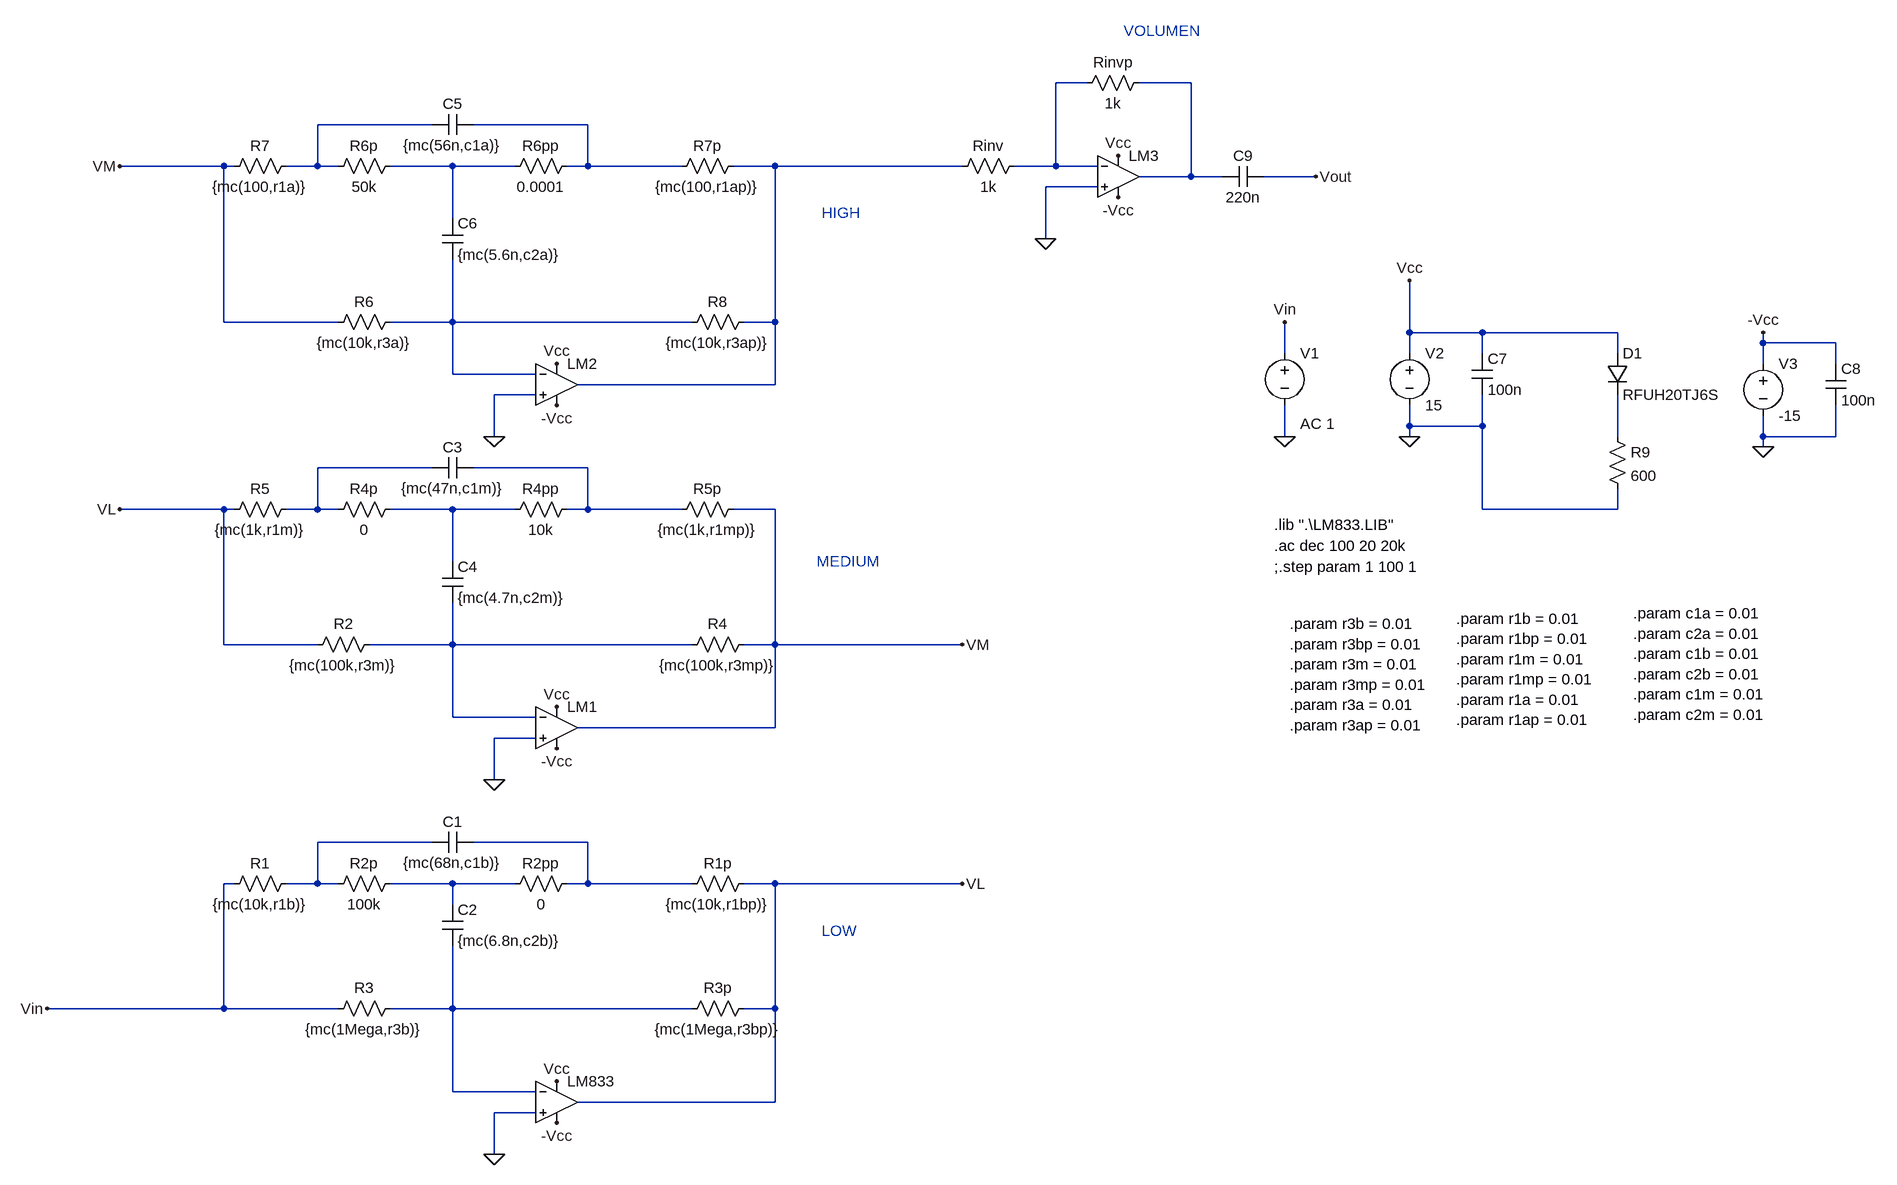
[diagram p0: schematic Circuito.asc]
Circuito.asc, the LTspice schematic file:
Version 4
SHEET 1 3748 680
WIRE 2528 -1184 2480 -1184
WIRE 2688 -1184 2608 -1184
WIRE 1520 -1120 1344 -1120
WIRE 1760 -1120 1584 -1120
WIRE 1200 -1056 1040 -1056
WIRE 1216 -1056 1200 -1056
WIRE 1344 -1056 1344 -1120
WIRE 1344 -1056 1296 -1056
WIRE 1376 -1056 1344 -1056
WIRE 1552 -1056 1456 -1056
WIRE 1648 -1056 1552 -1056
WIRE 1760 -1056 1760 -1120
WIRE 1760 -1056 1728 -1056
WIRE 1904 -1056 1760 -1056
WIRE 2048 -1056 1984 -1056
WIRE 2336 -1056 2048 -1056
WIRE 2480 -1056 2480 -1184
WIRE 2480 -1056 2416 -1056
WIRE 2544 -1056 2480 -1056
WIRE 2688 -1040 2688 -1184
WIRE 2688 -1040 2608 -1040
WIRE 2736 -1040 2688 -1040
WIRE 2880 -1040 2800 -1040
WIRE 2544 -1024 2464 -1024
WIRE 1552 -976 1552 -1056
WIRE 2464 -944 2464 -1024
WIRE 1200 -816 1200 -1056
WIRE 1376 -816 1200 -816
WIRE 1552 -816 1552 -912
WIRE 1552 -816 1456 -816
WIRE 1920 -816 1552 -816
WIRE 2048 -816 2048 -1056
WIRE 2048 -816 2000 -816
WIRE 3024 -800 3024 -880
WIRE 3136 -800 3024 -800
WIRE 3344 -800 3136 -800
WIRE 3568 -784 3568 -800
WIRE 3680 -784 3568 -784
WIRE 2832 -768 2832 -816
WIRE 3024 -768 3024 -800
WIRE 3136 -768 3136 -800
WIRE 3344 -768 3344 -800
WIRE 3568 -752 3568 -784
WIRE 3680 -752 3680 -784
WIRE 1552 -736 1552 -816
WIRE 1680 -736 1552 -736
WIRE 2048 -720 2048 -816
WIRE 2048 -720 1744 -720
WIRE 1680 -704 1616 -704
WIRE 3024 -656 3024 -688
WIRE 3136 -656 3136 -704
WIRE 3136 -656 3024 -656
WIRE 1616 -640 1616 -704
WIRE 2832 -640 2832 -688
WIRE 3024 -640 3024 -656
WIRE 3344 -640 3344 -704
WIRE 3568 -640 3568 -672
WIRE 3680 -640 3680 -688
WIRE 3680 -640 3568 -640
WIRE 3568 -624 3568 -640
WIRE 1520 -592 1344 -592
WIRE 1760 -592 1584 -592
WIRE 1200 -528 1040 -528
WIRE 1216 -528 1200 -528
WIRE 1344 -528 1344 -592
WIRE 1344 -528 1296 -528
WIRE 1376 -528 1344 -528
WIRE 1552 -528 1456 -528
WIRE 1648 -528 1552 -528
WIRE 1760 -528 1760 -592
WIRE 1760 -528 1728 -528
WIRE 1904 -528 1760 -528
WIRE 2048 -528 1984 -528
WIRE 3136 -528 3136 -656
WIRE 3344 -528 3344 -560
WIRE 3344 -528 3136 -528
WIRE 1552 -448 1552 -528
WIRE 1200 -320 1200 -528
WIRE 1344 -320 1200 -320
WIRE 1552 -320 1552 -384
WIRE 1552 -320 1424 -320
WIRE 1920 -320 1552 -320
WIRE 2048 -320 2048 -528
WIRE 2048 -320 2000 -320
WIRE 2336 -320 2048 -320
WIRE 1552 -208 1552 -320
WIRE 1680 -208 1552 -208
WIRE 2048 -192 2048 -320
WIRE 2048 -192 1744 -192
WIRE 1680 -176 1616 -176
WIRE 1616 -112 1616 -176
WIRE 1520 -16 1344 -16
WIRE 1760 -16 1584 -16
WIRE 1216 48 1200 48
WIRE 1344 48 1344 -16
WIRE 1344 48 1296 48
WIRE 1376 48 1344 48
WIRE 1552 48 1456 48
WIRE 1648 48 1552 48
WIRE 1760 48 1760 -16
WIRE 1760 48 1728 48
WIRE 1920 48 1760 48
WIRE 2048 48 2000 48
WIRE 2336 48 2048 48
WIRE 1552 80 1552 48
WIRE 1200 240 1200 48
WIRE 1200 240 928 240
WIRE 1376 240 1200 240
WIRE 1552 240 1552 144
WIRE 1552 240 1456 240
WIRE 1920 240 1552 240
WIRE 2048 240 2048 48
WIRE 2048 240 2000 240
WIRE 1552 368 1552 240
WIRE 1680 368 1552 368
WIRE 2048 384 2048 240
WIRE 2048 384 1744 384
WIRE 1680 400 1616 400
WIRE 1616 464 1616 400
FLAG 2832 -640 0
FLAG 3024 -640 0
FLAG 3568 -624 0
FLAG 1616 464 0
FLAG 2832 -816 Vin
FLAG 2880 -1040 Vout
FLAG 3024 -880 Vcc
FLAG 1712 352 Vcc
FLAG 3568 -800 -Vcc
FLAG 1712 416 -Vcc
FLAG 2464 -944 0
FLAG 2576 -1072 Vcc
FLAG 2576 -1008 -Vcc
FLAG 1616 -112 0
FLAG 1712 -224 Vcc
FLAG 1712 -160 -Vcc
FLAG 1616 -640 0
FLAG 1712 -752 Vcc
FLAG 1712 -688 -Vcc
FLAG 928 240 Vin
FLAG 1040 -528 VL
FLAG 2336 48 VL
FLAG 2336 -320 VM
FLAG 1040 -1056 VM
SYMBOL res 1472 32 R90
WINDOW 0 0 56 VBottom 2
WINDOW 3 32 56 VTop 2
SYMATTR InstName R2p
SYMATTR Value 100k
SYMBOL res 1744 32 R90
WINDOW 0 0 56 VBottom 2
WINDOW 3 32 56 VTop 2
SYMATTR InstName R2pp
SYMATTR Value 0
SYMBOL res 1472 224 R90
WINDOW 0 0 56 VBottom 2
WINDOW 3 32 56 VTop 2
SYMATTR InstName R3
SYMATTR Value {mc(1Mega,r3b)}
SYMATTR SpiceLine tol=5
SYMBOL res 2016 224 R90
WINDOW 0 0 56 VBottom 2
WINDOW 3 32 56 VTop 2
SYMATTR InstName R3p
SYMATTR Value {mc(1Mega,r3bp)}
SYMATTR SpiceLine tol=5
SYMBOL cap 1536 80 R0
SYMATTR InstName C2
SYMATTR Value {mc(6.8n,c2b)}
SYMBOL cap 1584 -32 R90
WINDOW 0 0 32 VBottom 2
WINDOW 3 32 32 VTop 2
SYMATTR InstName C1
SYMATTR Value {mc(68n,c1b)}
SYMBOL res 1312 32 R90
WINDOW 0 0 56 VBottom 2
WINDOW 3 32 56 VTop 2
SYMATTR InstName R1
SYMATTR Value {mc(10k,r1b)}
SYMATTR SpiceLine tol=1
SYMBOL res 2016 32 R90
WINDOW 0 0 56 VBottom 2
WINDOW 3 32 56 VTop 2
SYMATTR InstName R1p
SYMATTR Value {mc(10k,r1bp)}
SYMATTR SpiceLine tol=1
SYMBOL voltage 2832 -784 R0
WINDOW 123 24 124 Left 2
WINDOW 39 0 0 Left 0
SYMATTR Value2 AC 1
SYMATTR InstName V1
SYMATTR Value ""
SYMBOL voltage 3024 -784 R0
SYMATTR InstName V2
SYMATTR Value 15
SYMBOL voltage 3568 -768 R0
SYMATTR InstName V3
SYMATTR Value -15
SYMBOL res 1472 -544 R90
WINDOW 0 0 56 VBottom 2
WINDOW 3 32 56 VTop 2
SYMATTR InstName R4p
SYMATTR Value 0
SYMBOL res 1744 -544 R90
WINDOW 0 0 56 VBottom 2
WINDOW 3 32 56 VTop 2
SYMATTR InstName R4pp
SYMATTR Value 10k
SYMBOL cap 1584 -608 R90
WINDOW 0 0 32 VBottom 2
WINDOW 3 32 32 VTop 2
SYMATTR InstName C3
SYMATTR Value {mc(47n,c1m)}
SYMBOL res 1312 -544 R90
WINDOW 0 0 56 VBottom 2
WINDOW 3 32 56 VTop 2
SYMATTR InstName R5
SYMATTR Value {mc(1k,r1m)}
SYMATTR SpiceLine tol=1
SYMBOL res 2000 -544 R90
WINDOW 0 0 56 VBottom 2
WINDOW 3 32 56 VTop 2
SYMATTR InstName R5p
SYMATTR Value {mc(1k,r1mp)}
SYMATTR SpiceLine tol=1
SYMBOL res 1472 -1072 R90
WINDOW 0 0 56 VBottom 2
WINDOW 3 32 56 VTop 2
SYMATTR InstName R6p
SYMATTR Value 50k
SYMATTR SpiceLine tol=1
SYMBOL res 1744 -1072 R90
WINDOW 0 0 56 VBottom 2
WINDOW 3 32 56 VTop 2
SYMATTR InstName R6pp
SYMATTR Value 0.0001
SYMBOL cap 1584 -1136 R90
WINDOW 0 0 32 VBottom 2
WINDOW 3 32 32 VTop 2
SYMATTR InstName C5
SYMATTR Value {mc(56n,c1a)}
SYMBOL res 1312 -1072 R90
WINDOW 0 0 56 VBottom 2
WINDOW 3 32 56 VTop 2
SYMATTR InstName R7
SYMATTR Value {mc(100,r1a)}
SYMATTR SpiceLine tol=1
SYMBOL res 2000 -1072 R90
WINDOW 0 0 56 VBottom 2
WINDOW 3 32 56 VTop 2
SYMATTR InstName R7p
SYMATTR Value {mc(100,r1ap)}
SYMATTR SpiceLine tol=1
SYMBOL cap 1536 -448 R0
SYMATTR InstName C4
SYMATTR Value {mc(4.7n,c2m)}
SYMBOL cap 1536 -976 R0
SYMATTR InstName C6
SYMATTR Value {mc(5.6n,c2a)}
SYMBOL res 2432 -1072 R90
WINDOW 0 0 56 VBottom 2
WINDOW 3 32 56 VTop 2
SYMATTR InstName Rinv
SYMATTR Value 1k
SYMATTR SpiceLine tol=1
SYMBOL res 2624 -1200 R90
WINDOW 0 0 56 VBottom 2
WINDOW 3 32 56 VTop 2
SYMATTR InstName Rinvp
SYMATTR Value 1k
SYMBOL res 1440 -336 R90
WINDOW 0 0 56 VBottom 2
WINDOW 3 32 56 VTop 2
SYMATTR InstName R2
SYMATTR Value {mc(100k,r3m)}
SYMATTR SpiceLine tol=5
SYMBOL res 2016 -336 R90
WINDOW 0 0 56 VBottom 2
WINDOW 3 32 56 VTop 2
SYMATTR InstName R4
SYMATTR Value {mc(100k,r3mp)}
SYMATTR SpiceLine tol=5
SYMBOL res 1472 -832 R90
WINDOW 0 0 56 VBottom 2
WINDOW 3 32 56 VTop 2
SYMATTR InstName R6
SYMATTR Value {mc(10k,r3a)}
SYMATTR SpiceLine tol=5
SYMBOL res 2016 -832 R90
WINDOW 0 0 56 VBottom 2
WINDOW 3 32 56 VTop 2
SYMATTR InstName R8
SYMATTR Value {mc(10k,r3ap)}
SYMATTR SpiceLine tol=5
SYMBOL Opamps\\UniversalOpamp2 1712 384 R0
SYMATTR InstName LM833
SYMBOL Opamps\\UniversalOpamp2 1712 -192 R0
SYMATTR InstName LM1
SYMBOL Opamps\\UniversalOpamp2 1712 -720 R0
SYMATTR InstName LM2
SYMBOL Opamps\\UniversalOpamp2 2576 -1040 R0
SYMATTR InstName LM3
SYMBOL cap 3120 -768 R0
SYMATTR InstName C7
SYMATTR Value 100n
SYMBOL cap 3664 -752 R0
SYMATTR InstName C8
SYMATTR Value 100n
SYMBOL diode 3328 -768 R0
SYMATTR InstName D1
SYMATTR Value RFUH20TJ6S
SYMBOL res 3328 -656 R0
SYMATTR InstName R9
SYMATTR Value 600
SYMBOL cap 2800 -1056 R90
WINDOW 0 0 32 VBottom 2
WINDOW 3 32 32 VTop 2
SYMATTR InstName C9
SYMATTR Value 220n
TEXT 2816 -504 Left 2 !.lib ".\\LM833.LIB"
TEXT 2816 -472 Left 2 !.ac dec 100 20 20k
TEXT 2120 120 Left 2 ;LOW
TEXT 2112 -448 Left 2 ;MEDIUM
TEXT 2120 -984 Left 2 ;HIGH
TEXT 2584 -1264 Left 2 ;VOLUMEN
TEXT 2840 -352 Left 2 !.param r3b = 0.01\n.param r3bp = 0.01\n.param r3m = 0.01\n.param r3mp = 0.01\n.param r3a = 0.01\n.param r3ap = 0.01
TEXT 3096 -360 Left 2 !.param r1b = 0.01\n.param r1bp = 0.01\n.param r1m = 0.01\n.param r1mp = 0.01\n.param r1a = 0.01\n.param r1ap = 0.01
TEXT 2816 -440 Left 2 !;.step param 1 100 1
TEXT 3368 -368 Left 2 !.param c1a = 0.01\n.param c2a = 0.01\n.param c1b = 0.01\n.param c2b = 0.01\n.param c1m = 0.01\n.param c2m = 0.01

The netlist it stands for:
* Circuito.asc
R2p N015 N013 100k
R2pp N014 N015 0
R3 N016 Vin {mc(1Mega,r3b)} tol=5
R3p VL N016 {mc(1Mega,r3bp)} tol=5
C2 N015 N016 {mc(6.8n,c2b)}
C1 N014 N013 {mc(68n,c1b)}
R1 N013 Vin {mc(10k,r1b)} tol=1
R1p VL N014 {mc(10k,r1bp)} tol=1
V1 Vin 0 AC 1
V2 Vcc 0 15
V3 -Vcc 0 -15
R4p N011 N009 0
R4pp N010 N011 10k
C3 N010 N009 {mc(47n,c1m)}
R5 N009 VL {mc(1k,r1m)} tol=1
R5p VM N010 {mc(1k,r1mp)} tol=1
R6p N005 N003 50k tol=1
R6pp N004 N005 0.0001
C5 N004 N003 {mc(56n,c1a)}
R7 N003 VM {mc(100,r1a)} tol=1
R7p N006 N004 {mc(100,r1ap)} tol=1
C4 N011 N012 {mc(4.7n,c2m)}
C6 N005 N007 {mc(5.6n,c2a)}
Rinv N001 N006 1k tol=1
Rinvp N002 N001 1k
R2 N012 VL {mc(100k,r3m)} tol=5
R4 VM N012 {mc(100k,r3mp)} tol=5
R6 N007 VM {mc(10k,r3a)} tol=5
R8 N006 N007 {mc(10k,r3ap)} tol=5
XLM833 0 N016 Vcc -Vcc VL level.2 Avol=1Meg GBW=10Meg Slew=10Meg ilimit=25m rail=0 Vos=0 phimargin=45 en=0 enk=0 in=0 ink=0 Rin=500Meg  ; pins IN+ IN- V+ V- OUT
XLM1 0 N012 Vcc -Vcc VM level.2 Avol=1Meg GBW=10Meg Slew=10Meg ilimit=25m rail=0 Vos=0 phimargin=45 en=0 enk=0 in=0 ink=0 Rin=500Meg  ; pins IN+ IN- V+ V- OUT
XLM2 0 N007 Vcc -Vcc N006 level.2 Avol=1Meg GBW=10Meg Slew=10Meg ilimit=25m rail=0 Vos=0 phimargin=45 en=0 enk=0 in=0 ink=0 Rin=500Meg  ; pins IN+ IN- V+ V- OUT
XLM3 0 N001 Vcc -Vcc N002 level.2 Avol=1Meg GBW=10Meg Slew=10Meg ilimit=25m rail=0 Vos=0 phimargin=45 en=0 enk=0 in=0 ink=0 Rin=500Meg  ; pins IN+ IN- V+ V- OUT
C7 Vcc 0 100n
C8 -Vcc 0 100n
D1 Vcc N008 RFUH20TJ6S
R9 N008 0 600
C9 Vout N002 220n
.model D D
.lib standard.dio
.lib ".\LM833.LIB"
.ac dec 100 20 20k
* LOW
* MEDIUM
* HIGH
* VOLUMEN
.param r3b = 0.01
.param r3bp = 0.01
.param r3m = 0.01
.param r3mp = 0.01
.param r3a = 0.01
.param r3ap = 0.01
.param r1b = 0.01
.param r1bp = 0.01
.param r1m = 0.01
.param r1mp = 0.01
.param r1a = 0.01
.param r1ap = 0.01
;.step param 1 100 1
.param c1a = 0.01
.param c2a = 0.01
.param c1b = 0.01
.param c2b = 0.01
.param c1m = 0.01
.param c2m = 0.01
.lib UniversalOpamps2.sub
.backanno
.end